# Altium project Jammer V1.PrjPcb
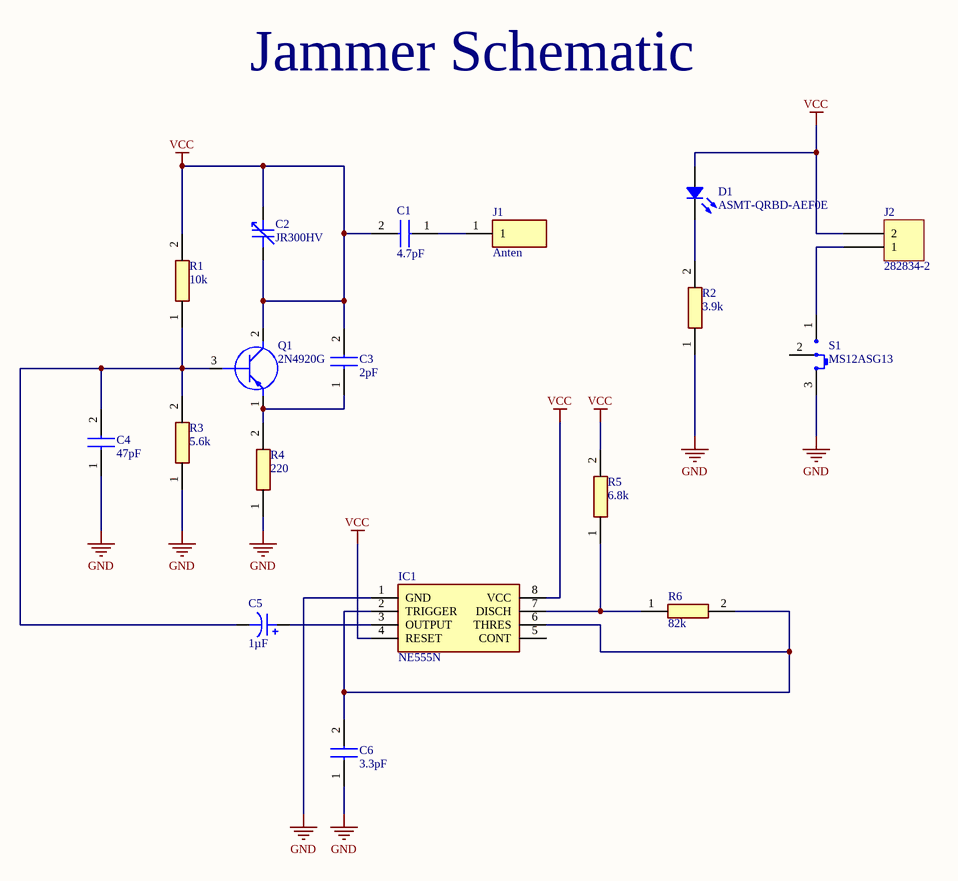
[diagram p0: Sheet1.SchDoc]
1 sheet, 18 parts. Net scope: global (net labels, ports and power ports of the same name join across sheets).
Board file: PCB2.PcbDoc

## Sheet Sheet1.SchDoc
size A4; SheetNumber: 1; SheetTotal: 1

### Parts
C1  4.7pF  [561R10TCCQ50]
C2  JR300HV  [KNOWLES JR]
C3  2pF  [561R10TCCQ50]
C4  47pF  [561R10TCCQ50]
C5  1µF  [CAP TH ALUM ELEC D5.00mm S2.00mm H12.50mm]
C6  3.3pF  [561R10TCCQ50]
D1  ASMT-QRBD-AEF0E  [Broadcom 4-PLLC 3228]
IC1  NE555N  [DIP762W56P254L959H533Q8N]
J1  Anten  [M3902958360]
J2  282834-2  [TE 282834-2]
Q1  2N4920G  [TO229P300X760X1364-3P]
R1  10k  [RESAD1987W56L1031D239]
R2  3.9k  [RESAD1987W56L1031D239]
R3  5.6k  [RESAD1987W56L1031D239]
R4  220  [RESAD1987W56L1031D239]
R5  6.8k  [RESAD1987W56L1031D239]
R6  82k  [RESAD1987W56L1031D239]
S1  MS12ASG13  [NKK MS12ASG13]

### Nets
GND: C4.1 C6.1 IC1.1(GND) R2.1 R3.1 R4.1 S1.3
VCC: C1.2 C2.1 C2.2 C3.2 D1.1 IC1.4(RESET) IC1.8(VCC) J2.2 Q1.2(C) R1.2 R5.2
NetC1_1: C1.1 J1.1
NetC3_1: C3.1 Q1.1(E) R4.2
NetC4_2: C4.2 C5.2 Q1.3(B) R1.1 R3.2
NetC5_1: C5.1 IC1.3(OUTPUT)
NetC6_2: C6.2 IC1.2(TRIGGER) IC1.6(THRES) R6.2
NetD1_2: D1.2 R2.2
NetIC1_7: IC1.7(DISCH) R5.1 R6.1
NetJ2_1: J2.1 S1.1

Not connected (* = marked no-connect by the designer): IC1 5(CONT); S1 2(COM)

### Notes on the sheet
- Jammer Schematic

### Library data of the parts
C1 C3 C4 C6 = 561R10TCCQ50: Capacitor; Manufacturer_Name: Vishay; Datasheet Link: https://componentsearchengine.com/Datasheets/2/561R10TCCQ50.pdf; Height: 11.2mm; Manufacturer_Part_Number: 561R10TCCQ50; Mouser Part Number: 75-561R10TCCQ50; Mouser Price/Stock: https://www.mouser.co.uk/ProductDetail/Vishay-Cera-Mite/561R10TCCQ50?qs=XeJOwCSCkv8TfOZSduXdBA%3D%3D
C2 = JR300HV: CAP TRIMMER 5.5-30PF 350V SMD; Manufacturer: Knowles Voltronics; Adjustment Type: Top; Capacitance Range: 5.5 ~ 30pF; Dielectric Material: Ceramic; Q @ Freq: 200 @ 1MHz; Part Number: JR300HV; ComponentLink1Description: Datasheet; ComponentLink1URL: https://www.knowlescapacitors.com/getattachment/727ef5bd-b9cf-4698-a84c-cd891d1f5273/JR-Series; ComponentLink2Description: DigiKey Link; ComponentLink2URL: https://www.digikey.com/en/products/detail/knowles-voltronics/JR300HV/17955420; Features: General Purpose; Height - Seated (Max): 0.045" (1.15mm); LastUpdated: 3.06.2024 20:26:22; Lifecycle Status: Active; Minimum Order: 1; Mounting Type: Surface Mount; Operating Temperature: -40°C ~ 85°C; Packaging: Bulk; Price: 2.17; Series: JR; Size / Dimension: 0.138" L x 0.122" W (3.50mm x 3.10mm); Supplier 1: DigiKey; Supplier Part Number 1: 1674-JR300HV-ND
C5 = 860010772005: CAP 1 UF 20% 63 V; manufacturer: Würth Elektronik; Lifetime @ Temp.: 2000 Hrs @ 85°C; Polarization: Polar; Ripple Current @ High Frequency: 28.9mA @ 100kHz; Ripple Current @ Low Frequency: 17mA @ 120Hz; Voltage - Rated: 63V; Part Number: 860010772005; Applications: General Purpose; Capacitance: 1µF; componentlink1description: Datasheet; componentlink1url: https://katalog.we-online.de/pbs/datasheet/860010772005.pdf; componentlink2description: DigiKey Link; componentlink2url: http://digikey.com/product-detail/en/w-rth-elektronik/860010772005/732-8762-1-ND/5728709; Device Package: Radial, Can; Height - Seated (Max): 0.492" (12.50mm); lastupdated: 4.09.2020 23:29:02; Lead Spacing: 0.079" (2.00mm); Lifecycle Status: Active; Minimum Order: 1; Mounting Type: Through Hole; Operating Temperature: -40°C ~ 85°C; Package / Case: Radial, Can; packaging: TapeAndBox; partid: 22163; Part Status: Active; price: 0.06; series: WCAP-ATG8; Size / Dimension: 0.197" Dia (5.00mm); Supplier 1: DigiKey; Supplier Part Number 1: 732-8762-1-ND; Tolerance: ±20%; value: 1µF
D1 = ASMT-QRBD-AEF0E: LED INDICATOR 0.5W RED 4PLCC; Manufacturer: Broadcom Limited; Current - Max: 300mA; Current - Test: 150mA; Flux @ Current/Temperature - Test: 16lm (12lm ~ 20lm); Lumens/Watt @ Current - Test: 43 lm/W; Temperature - Test: 25°C; Viewing Angle: 120°; Voltage - Forward (Vf) (Typ): 2.5V; Wavelength: 628nm (620nm ~ 635nm); Part Number: ASMT-QRBD-AEF0E; Color: Red; ComponentLink1Description: Datasheet; ComponentLink1URL: https://docs.broadcom.com/docs/AV02-1841EN; ComponentLink2Description: DigiKey Link; ComponentLink2URL: http://digikey.com/product-detail/en/broadcom-limited/ASMT-QRBD-AEF0E/516-2679-1-ND/3909187; Device Package: 4-PLCC; Height - Seated (Max): 0.083" (2.10mm); LastUpdated: 24.04.2020 00:57:49; Lifecycle Status: Active; Minimum Order: 1; Mounting Type: Surface Mount; Package / Case: 4-PLCC; Packaging: TapeAndReel; Part Status: Active; Price: 0.42; Size / Dimension: 0.126" L x 0.110" W (3.20mm x 2.80mm); Supplier 1: DigiKey; Supplier Part Number 1: 516-2679-1-ND; Supplier Device Package: 4-PLCC
IC1 = NE555N: Integrated Circuit; Manufacturer_Name: HGSEMI; Datasheet Link: https://datasheet.lcsc.com/szlcsc/1906111919_HGSEMI-NE555N_C398063.pdf; Height: 5.33mm; Manufacturer_Part_Number: NE555N
J1 = M39029_58-360: Connector; Manufacturer_Name: TE Connectivity; Manufacturer_Part_Number: M39029/58-360; Datasheet Link: https://www.te.com/commerce/DocumentDelivery/DDEController?Action=showdoc&DocId=Customer+Drawing%7F204370%7FU%7Fpdf%7FEnglish%7FENG_CD_204370_U.pdf%7F204370-2; Height: 13.6144mm; Mouser Part Number: 571-M39029/58-360; Mouser Price/Stock: https://www.mouser.co.uk/ProductDetail/TE-Connectivity-DEUTSCH/M39029-58-360?qs=9HV4TyDAT3A%2FQtXMfnQD4Q%3D%3D; Arrow Part Number: M39029/58-360; Arrow Price/Stock: https://www.arrow.com/en/products/m3902958-360/deutsch-group?region=nac
J2 = 282834-2: TERM BLK 2P SIDE ENT 2.54MM PCB; Manufacturer: TE Connectivity AMP Connectors; Current: 10A; Mating Orientation: Horizontal with Board; Number of Levels: 1; Pitch: 0.100" (2.54mm); Positions Per Level: 2; Voltage: 150V; Wire Gauge: 16-30 AWG; Wire Termination: Screw - Rising Cage Clamp; Part Number: 282834-2; Color: Green; ComponentLink1Description: Datasheet; ComponentLink1URL: https://www.te.com/commerce/DocumentDelivery/DDEController?Action=srchrtrv&DocNm=282834&DocType=Customer+Drawing&DocLang=English; ComponentLink2Description: DigiKey Link; ComponentLink2URL: http://digikey.com/product-detail/en/te-connectivity-amp-connectors/282834-2/A98333-ND/1150135; LastUpdated: 15.01.2020 04:15:38; Lifecycle Status: Active; Minimum Order: 1; Mounting Type: Through Hole; Packaging: Bulk; Part Status: Active; Price: 0.88; Series: Buchanan; Supplier 1: DigiKey; Supplier Part Number 1: A98333-ND
Q1 = 2N4920G: Transistor BJT PNP; Manufacturer_Name: onsemi; Datasheet Link: http://www.onsemi.com/pub/Collateral/2N4918-D.PDF; Height: 3mm; Manufacturer_Part_Number: 2N4920G; Mouser Part Number: 863-2N4920G; Mouser Price/Stock: https://www.mouser.co.uk/ProductDetail/ON-Semiconductor/2N4920G/?qs=vLkC5FC1VN9gzlxCmMsLdw%3D%3D; Arrow Part Number: 2N4920G; Arrow Price/Stock: https://www.arrow.com/en/products/2n4920g/on-semiconductor
R1-R6 = RS01A1R000FE12: Resistor; Manufacturer_Name: Vishay; Datasheet Link: http://www.mouser.com/ds/2/427/rsns-226497.pdf; Manufacturer_Part_Number: RS01A1R000FE12; Mouser Part Number: 71-RS01A1R000FE12; Mouser Price/Stock: https://www.mouser.co.uk/ProductDetail/Vishay-Dale/RS01A1R000FE12?qs=pX8%252BLszEE6SqU%2F4VU%252B6gEw%3D%3D; Arrow Part Number: RS01A1R000FE12; Arrow Price/Stock: https://www.arrow.com/en/products/rs01a1r000fe12/vishay?region=nac
S1 = MS12ASG13: SWITCH SLIDE SPDT 0.4VA 28V; Manufacturer: NKK Switches; Actuator Length: 5.10mm; Actuator Type: Standard; Contact Timing: Non-Shorting (BBM); Current Rating (Amps): 0.4VA (AC/DC); Switch Function: On-On; Part Number: MS12ASG13; Circuit: SPDT; ComponentLink1Description: Datasheet; ComponentLink1URL: https://www.nkkswitches.com/pdf/MSnonilluminated.pdf; ComponentLink2Description: DigiKey Link; ComponentLink2URL: https://www.digikey.com/en/products/detail/nkk-switches/MS12ASG13/1052535; Contact Finish: Gold; Contact Material: Copper; Features: Epoxy Sealed Terminals; LastUpdated: 26.09.2022 03:18:31; Lifecycle Status: Active; Minimum Order: 1; Mounting Type: Through Hole; Operating Temperature: -30°C ~ 85°C; Packaging: Bulk; PartId: 6; Part Status: Active; Price: 2.95; Series: MS; Supplier 1: DigiKey; Supplier Part Number 1: 360-2388-ND; Termination Style: PC Pin; Voltage Rating - AC: 28 V; Voltage Rating - DC: 28 V